# Altium schematic sheet LoRaSnow.SchDoc
size A4; CompanyName: HESSO; Address1: Route du Rawyl 47; Address2: 1950 Sion; Address3: Switzerland; PageSetup: Record=PageOptions|CenterHorizontal=True|CenterVertical=True|PrintScale=1.00|XCorrection=1.00|YCorrection=1.00|PrintKind=1|BorderSize=5000000|LeftOffset=0|BottomOffset=0|Orientation=2|PaperLength=1000|PaperWidth=1000|Scale=100|PaperSource=15|PrintQuality=1200|MediaType=1|DitherType=10|PrintScaleMode=1|PaperKind=A4|PaperIndex=9; ProjectName: Project Name
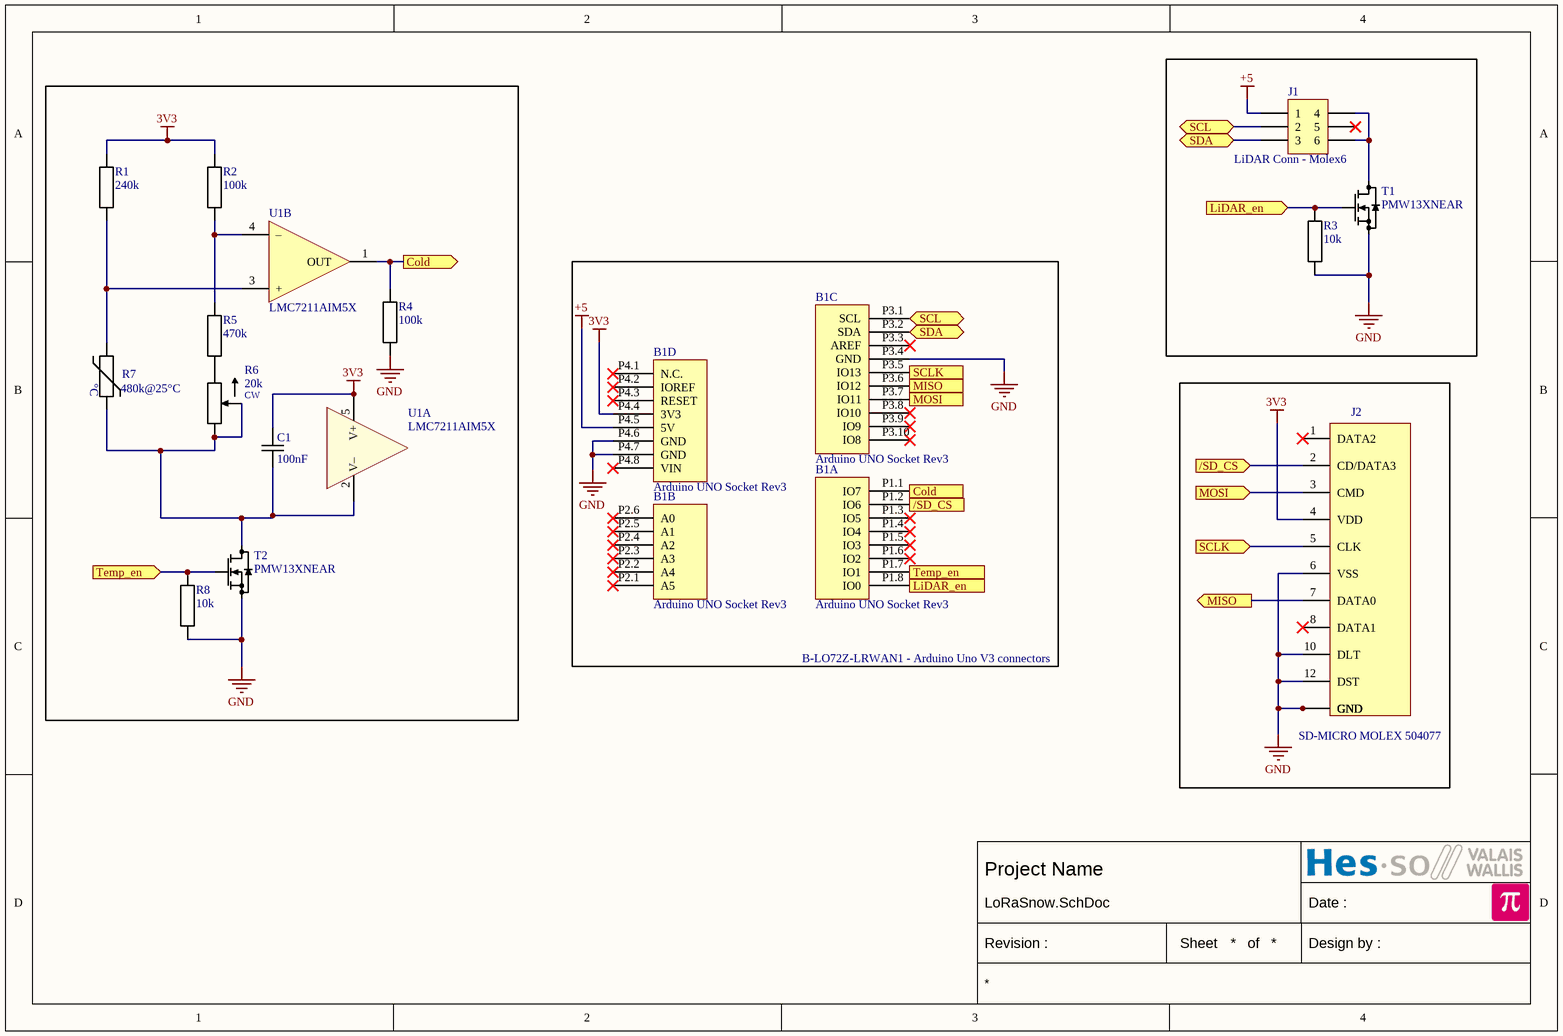
[diagram p0: LoRaSnow.SchDoc]

## Parts
B1  Arduino UNO Socket Rev3  [Arduino Uno Socket Rev3]  (parts A,B,C,D of 4)
C1  100nF  [CAPACITOR 1608 REFLOW]
J1  LiDAR Conn - Molex6  [MOLEX 43045-0600]
J2  SD-MICRO MOLEX 504077  [SD MICRO MOLEX 504077]
R1  240k  [RESISTOR 1608 REFLOW]
R2  100k  [RESISTOR 1608 REFLOW]
R3  10k  [RESISTOR 1608 REFLOW]
R4  100k  [RESISTOR 1608 REFLOW]
R5  470k  [RESISTOR 1608 REFLOW]
R6  20k  [Trimmer BOURNS 3266W]
R7  480k@25°C  [RESISTOR 1608 REFLOW]
R8  10k  [RESISTOR 1608 REFLOW]
T1  PMW13XNEAR  [SOT23 P0.95 C1.6x3.0 H1.3]
T2  PMW13XNEAR  [SOT23 P0.95 C1.6x3.0 H1.3]
U1  LMC7211AIM5X  [SOT23-5 P0.95 C1.6x3.0 H1.3]  (parts A,B of 2)

## Blocks framed on the sheet
B-LO72Z-LRWAN1 - Arduino Uno V3 connectors: B1

## Ports
/SD_CS (in), /SD_CS (out), Cold (in), Cold (out), LiDAR_en (in), LiDAR_en (out), MISO (in), MISO (out), MOSI (in), MOSI (out), SCL (bidir), SCLK (in), SCLK (out), SDA (bidir), Temp_en (in), Temp_en (out)

## Nets
3V3: B1.P4.4(3V3) C1.2 J2.4(VDD) R1.2 R2.2 U1.5(V+)
+5: B1.P4.5(5V) J1.1
GND: B1.P3.4(GND) B1.P4.6(GND) B1.P4.7(GND) J2.6(VSS) J2.9(GND) J2.10(DLT) J2.11(GND) J2.12(DST) J2.13(GND) J2.14(GND) J2.15(GND) J2.16(GND) R3.1 R4.1 R8.1 T1.2(S) T2.2(S)
/SD_CS: B1.P1.2(IO6) J2.2(CD/DATA3) ; port /SD_CS
Cold: B1.P1.1(IO7) R4.2 U1.1(OUT) ; port Cold
LiDAR_en: B1.P1.8(IO0) R3.2 T1.1(G) ; port LiDAR_en
MISO: B1.P3.6(IO12) J2.7(DATA0) ; port MISO
MOSI: B1.P3.7(IO11) J2.3(CMD) ; port MOSI
SCL: B1.P3.1(SCL) J1.2 ; port SCL
SCLK: B1.P3.5(IO13) J2.5(CLK) ; port SCLK
SDA: B1.P3.2(SDA) J1.3 ; port SDA
Temp_en: B1.P1.7(IO1) R8.2 T2.1(G) ; port Temp_en
NetC1_1: C1.1 R6.1 R6.2(WIPER) R7.2 T2.3(D) U1.2(V–)
NetJ1_4: J1.4 J1.6 T1.3(D)
NetR1_1: R1.1 R7.1 U1.3(+)
NetR2_1: R2.1 R5.2 U1.4(–)
NetR5_1: R5.1 R6.3

Not connected (* = marked no-connect by the designer): B1 P1.3(IO5)* P1.4(IO4)* P1.5(IO3)* P1.6(IO2)* P2.1(A5)* P2.2(A4)* P2.3(A3)* P2.4(A2)* P2.5(A1)* P2.6(A0)* P3.3(AREF)* P3.8(IO10)* P3.9(IO9)* P3.10(IO8)* P4.1(N.C.)* P4.2(IOREF)* P4.3(RESET)* P4.8(VIN)*; J1 5*; J2 1(DATA2)* 8(DATA1)*

## Notes on the sheet
- Date :
- Revision :
- Sheet
- of
- Design by :
- (in symbol Thermal Resistor) °C

## Library data of the parts
B1 = Arduino UNO Socket Rev3: Microcontroller board based on the ATmega328P Rev3; Value: Arduino UNO Socket Rev3
C1 = Capacitor: Value: 100nF
J1 = MOLEX 43045-0600: Micro-Fit 3.0 Right-Angle Header, 3.00mm Pitch, Dual Row, 6 Circuits
J2 = SD-MICRO MOLEX 504077: SD Card Micro
R1-R5 R8 = Resistor
  R1: Value: 240k
  R2 R4: Value: 100k
  R3 R8: Value: 10k
  R5: Value: 470k
R6 = Trimmer: Value: 20k; CW: CW
R7 = Thermal Resistor: Value: 480k@25°C
T1 T2 = MOS-N SOT23 G-S-D: Generic MOS-N; Value: PMW13XNEAR
U1 = COMPARATOR SINGLE SOT23-5: Generic Single Comparator 5pins 1OUT/2-V/3+IN/4-IN/5+V; Value: LMC7211AIM5X